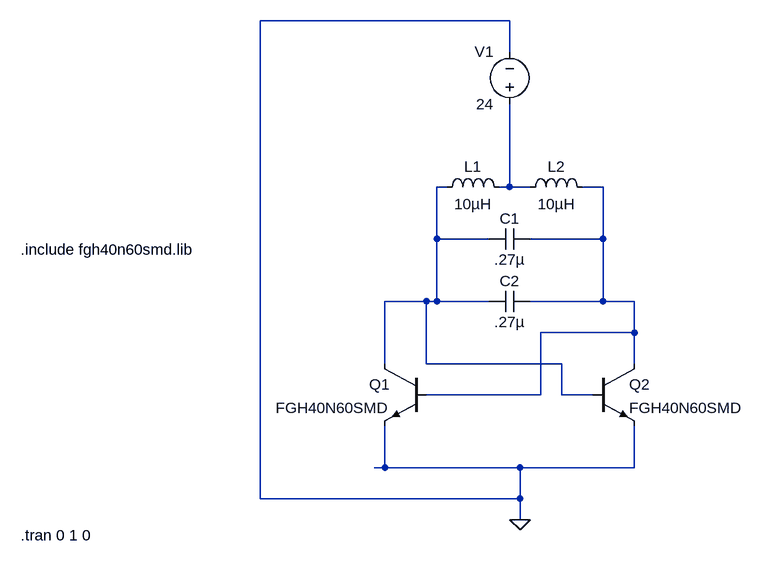
[diagram p0: schematic vibrator.asc]
vibrator.asc, the LTspice schematic file:
Version 4.1
SHEET 1 956 680
WIRE 576 -352 192 -352
WIRE 576 -304 576 -352
WIRE 480 -96 464 -96
WIRE 576 -96 576 -224
WIRE 576 -96 560 -96
WIRE 608 -96 576 -96
WIRE 720 -96 688 -96
WIRE 464 -16 464 -96
WIRE 544 -16 464 -16
WIRE 720 -16 720 -96
WIRE 720 -16 608 -16
WIRE 448 80 384 80
WIRE 464 80 464 -16
WIRE 464 80 448 80
WIRE 544 80 464 80
WIRE 720 80 720 -16
WIRE 720 80 608 80
WIRE 768 80 720 80
WIRE 768 128 768 80
WIRE 768 128 624 128
WIRE 384 176 384 80
WIRE 448 176 448 80
WIRE 656 176 448 176
WIRE 768 176 768 128
WIRE 624 224 624 128
WIRE 624 224 448 224
WIRE 656 224 656 176
WIRE 704 224 656 224
WIRE 384 336 384 272
WIRE 384 336 368 336
WIRE 592 336 384 336
WIRE 768 336 768 272
WIRE 768 336 592 336
WIRE 192 384 192 -352
WIRE 592 384 592 336
WIRE 592 384 192 384
WIRE 592 416 592 384
FLAG 592 416 0
SYMBOL npn 448 176 M0
SYMATTR InstName Q1
SYMATTR Value FGH40N60SMD
SYMATTR Prefix X
SYMATTR SpiceModel FGH40N60SMD
SYMBOL npn 704 176 R0
SYMATTR InstName Q2
SYMATTR Value FGH40N60SMD
SYMATTR Prefix X
SYMATTR SpiceModel FGH40N60SMD
SYMBOL cap 608 -32 R90
WINDOW 0 0 32 VBottom 2
WINDOW 3 32 32 VTop 2
SYMATTR InstName C1
SYMATTR Value .27µ
SYMATTR SpiceLine V=600
SYMBOL cap 608 64 R90
WINDOW 0 0 32 VBottom 2
WINDOW 3 32 32 VTop 2
SYMATTR InstName C2
SYMATTR Value .27µ
SYMATTR SpiceLine V=600
SYMBOL ind 576 -80 M270
WINDOW 0 32 56 VTop 2
WINDOW 3 5 56 VBottom 2
SYMATTR InstName L1
SYMATTR Value 10µH
SYMATTR SpiceLine Rser=1m
SYMBOL ind 704 -80 M270
WINDOW 0 32 56 VTop 2
WINDOW 3 5 56 VBottom 2
SYMATTR InstName L2
SYMATTR Value 10µH
SYMATTR SpiceLine Rser=1m
SYMBOL voltage 576 -208 R180
WINDOW 0 24 96 Left 2
WINDOW 3 24 16 Left 2
WINDOW 123 0 0 Left 0
WINDOW 39 0 0 Left 0
SYMATTR InstName V1
SYMATTR Value 24
TEXT -176 0 Left 2 !.include fgh40n60smd.lib
TEXT -176 440 Left 2 !.tran 0 1 0

The netlist it stands for:
* vibrator.asc
X§Q1 N001 N003 0 FGH40N60SMD FGH40N60SMD  ; pins C B E
X§Q2 N003 N001 0 FGH40N60SMD FGH40N60SMD  ; pins C B E
C1 N003 N001 .27µ V=600
C2 N003 N001 .27µ V=600
L1 N002 N001 10µH Rser=1m
L2 N003 N002 10µH Rser=1m
V1 N002 0 24
.include fgh40n60smd.lib
.tran 0 1 0
.backanno
.end